# EAGLE design qPCR_pcb_breakout_AD630ARZ (EAGLE 9.6.1)
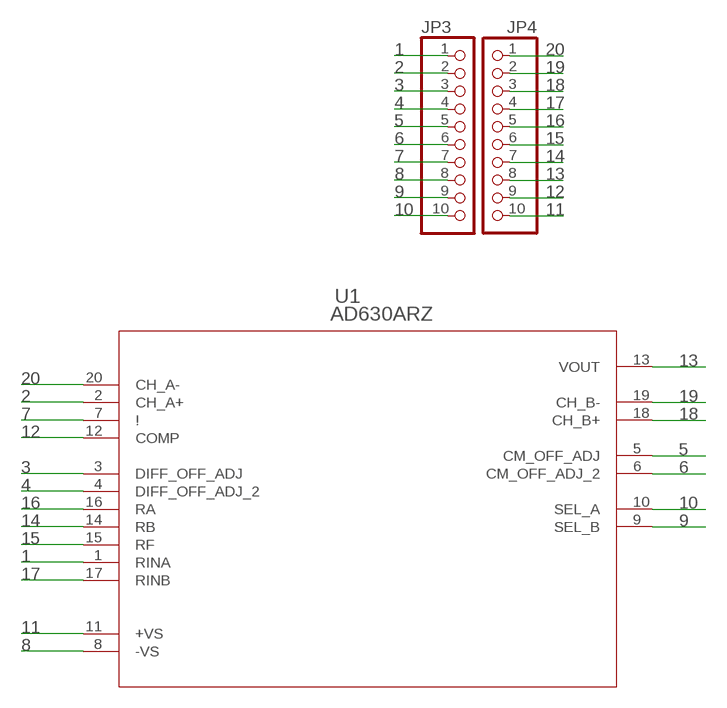
[diagram p0: schematic, sheet 1]

## Parts
JP3  PINHD-1X10  [1X10]
JP4  PINHD-1X10  [1X10]
U1  AD630ARZ  [RW_20_ADI]

## Nets
1: JP3.1 U1.1(RINA)
2: JP3.2 U1.2(CH_A+)
3: JP3.3 U1.3(DIFF_OFF_ADJ)
4: JP3.4 U1.4(DIFF_OFF_ADJ_2)
5: JP3.5 U1.5(CM_OFF_ADJ)
6: JP3.6 U1.6(CM_OFF_ADJ_2)
7: JP3.7 U1.7(!)
8: JP3.8 U1.8(-VS)
9: JP3.9 U1.9(SEL_B)
10: JP3.10 U1.10(SEL_A)
11: JP4.10 U1.11(+VS)
12: JP4.9 U1.12(COMP)
13: JP4.8 U1.13(VOUT)
14: JP4.7 U1.14(RB)
15: JP4.6 U1.15(RF)
16: JP4.5 U1.16(RA)
17: JP4.4 U1.17(RINB)
18: JP4.3 U1.18(CH_B+)
19: JP4.2 U1.19(CH_B-)
20: JP4.1 U1.20(CH_A-)

## Library data of the parts
JP3 JP4 = pinhead:PINHD-1X10: PIN HEADER
U1 = Ninja_qPCR:AD630ARZ; BUILT_BY: EMA_UL_Team; MANUFACTURER_PART_NUMBER: AD630ARZ; SOURCELIBRARY: Analog_2012-01-01_3; VENDOR: Analog Devices Inc

## Board
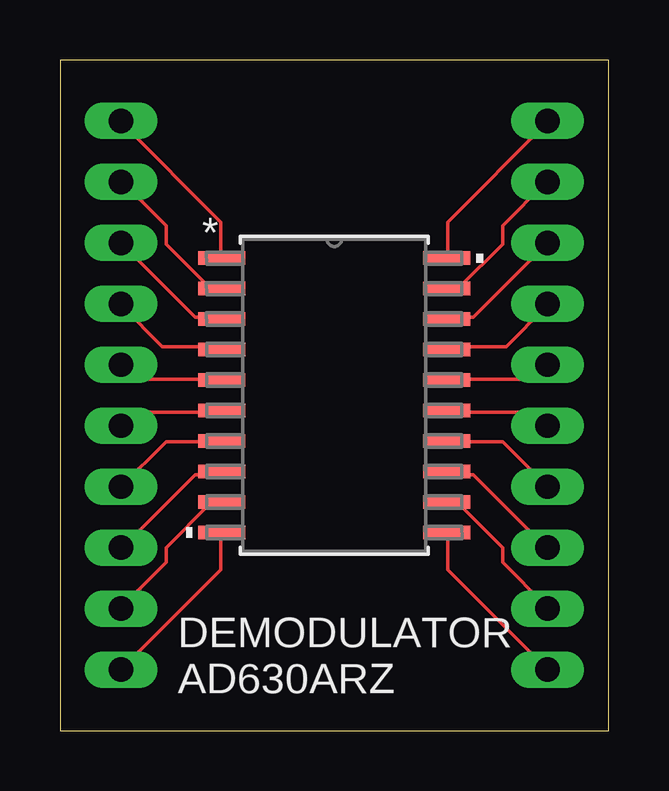
[diagram p1: board, top side]
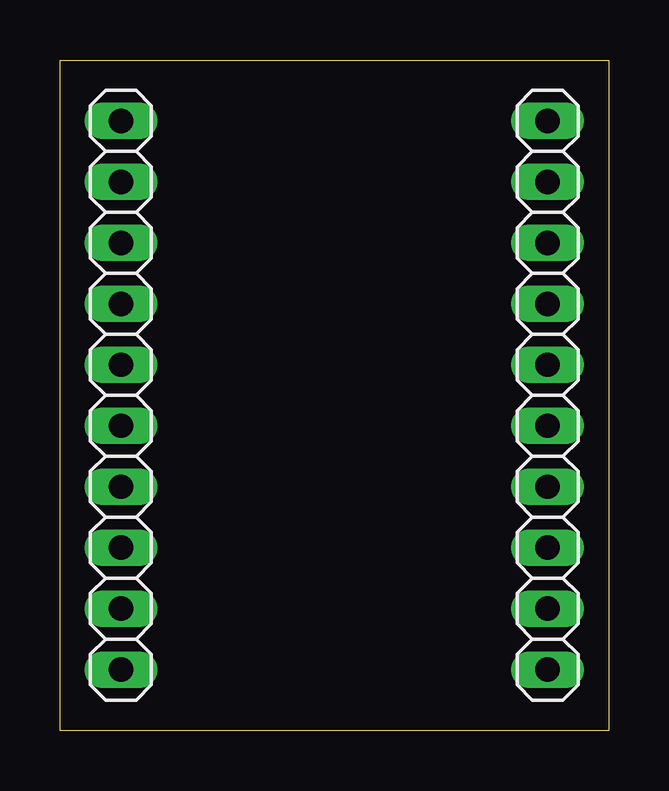
[diagram p2: board, bottom side, seen from below]

Size 22.86 x 27.94 mm. Coordinates in mm from the lower left corner, seen from the top.
Outline: 0,0 22.86,0 22.86,27.94 0,27.94 0,0
Copper layers (1*16): Top 0.035mm / dielectric 1.5mm / Bottom 0.035mm
Design rules "default": minimum track width 6mil, minimum drill 0.35mm, track to track 6mil, track to pad 6mil, pad to pad 6mil, via to via 6mil, smd to smd 6mil, copper to edge 40mil, drill to drill 6mil, minimum pad ring 10mil, minimum via ring 8mil, stop-mask expansion 4mil, vias tented up to drill 0mil, thermal gap 10mil

### Footprints (pad centres in the part's own frame; a part is rotated, then mirrored left to right if it is on the bottom)
1X10 = drill 1.016 long: 1 -11.43,0; 2 -8.89,0; 3 -6.35,0; 4 -3.81,0; 5 -1.27,0; 6 1.27,0; 7 3.81,0; 8 6.35,0; 9 8.89,0; 10 11.43,0
RW_20_ADI = smd 1.97 x 0.568: 1 -4.686,5.715; 2 -4.686,4.445; 3 -4.686,3.175; 4 -4.686,1.905; 5 -4.686,0.635; 6 -4.686,-0.635; 7 -4.686,-1.905; 8 -4.686,-3.175; 9 -4.686,-4.445; 10 -4.686,-5.715; 11 4.686,-5.715; 12 4.686,-4.445; 13 4.686,-3.175; 14 4.686,-1.905; 15 4.686,-0.635; 16 4.686,0.635; 17 4.686,1.905; 18 4.686,3.175; 19 4.686,4.445; 20 4.686,5.715

### Placement (x,y rotation side)
JP3  2.54,13.97 270 bottom
JP4  20.32,13.97 270 bottom
U1  11.43,13.97 0 top

### Tracks (layer width: path | path; a pad name or v marks a point on that pad's centre or on a via)
1
  Top 0.152: U1.1 6.71,19.81 6.71,21.18 2.59,25.3 JP3.1
2
  Top 0.152: U1.2 6.71,18.44 6.25,18.44 4.42,20.27 4.42,21.03 2.59,22.86 JP3.2
3
  Top 0.152: JP3.3 5.64,17.22 6.71,17.22 U1.3
4
  Top 0.152: U1.4 6.71,16 4.27,16 2.59,17.68 JP3.4
5
  Top 0.152: U1.5 6.71,14.63 3.2,14.63 2.59,15.24 JP3.5
6
  Top 0.152: U1.6 6.71,13.26 3.05,13.26 2.59,12.8 JP3.6
7
  Top 0.152: JP3.7 4.42,12.04 6.71,12.04 U1.7
8
  Top 0.152: U1.8 6.71,10.67 5.64,10.67 2.59,7.62 JP3.8
9
  Top 0.152: U1.9 6.71,9.45 6.25,9.45 4.42,7.62 4.42,7.01 2.59,5.18 JP3.9
10
  Top 0.152: JP3.10 6.71,6.71 6.71,8.23 U1.10
11
  Top 0.152: JP4.10 16.15,6.71 16.15,8.23 U1.11
12
  Top 0.152: U1.12 16.15,9.45 16.61,9.45 18.44,7.62 18.44,7.01 20.27,5.18 JP4.9
13
  Top 0.152: U1.13 16.15,10.67 17.22,10.67 20.27,7.62 JP4.8
14
  Top 0.152: JP4.7 18.44,12.04 16.15,12.04 U1.14
15
  Top 0.152: U1.15 16.15,13.26 19.81,13.26 20.27,12.8 JP4.6
16
  Top 0.152: U1.16 16.15,14.63 19.66,14.63 20.27,15.24 JP4.5
17
  Top 0.152: U1.17 16.15,16 18.59,16 20.27,17.68 JP4.4
18
  Top 0.152: JP4.3 17.22,17.22 16.15,17.22 U1.18
19
  Top 0.152: U1.19 16.15,18.44 16.61,18.44 18.44,20.27 18.44,21.03 20.27,22.86 JP4.2
20
  Top 0.152: U1.20 16.15,19.81 16.15,21.18 20.27,25.3 JP4.1

### Text on the board
tPlace: DEMODULATOR / AD630ARZ